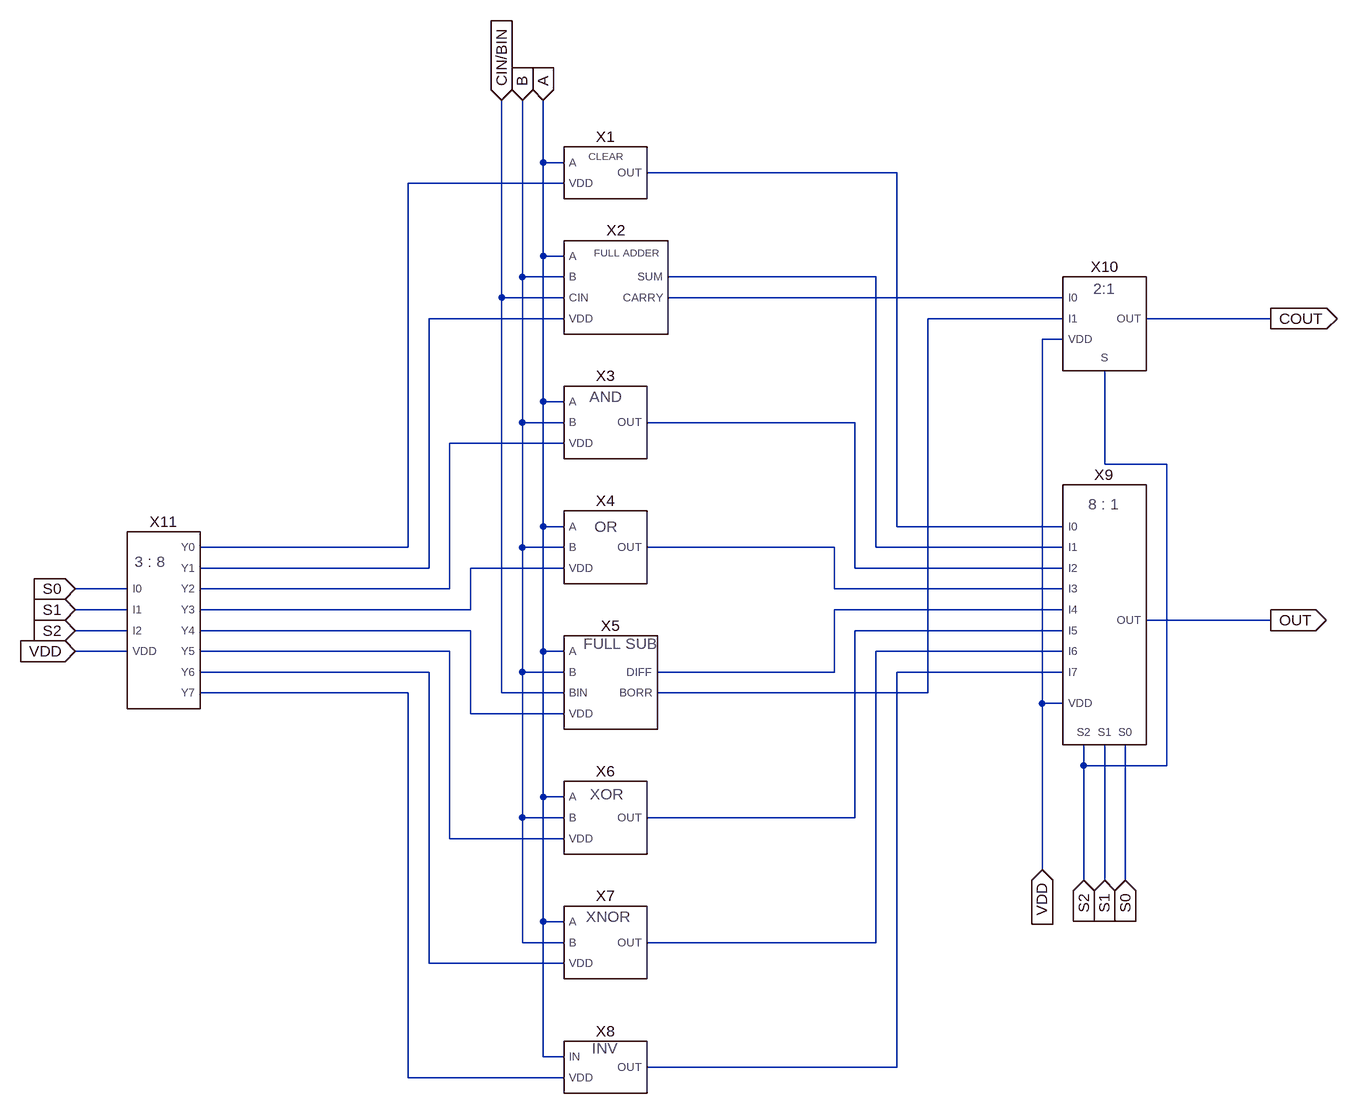
[diagram p0: schematic OneBitALU_CMOS.asc]
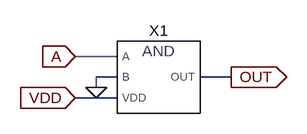
[diagram p1: sub-circuit clearcmos.asc]
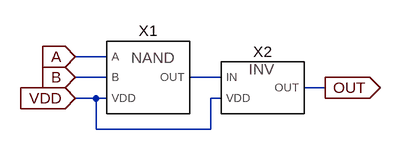
[diagram p2: sub-circuit andcmos.asc]
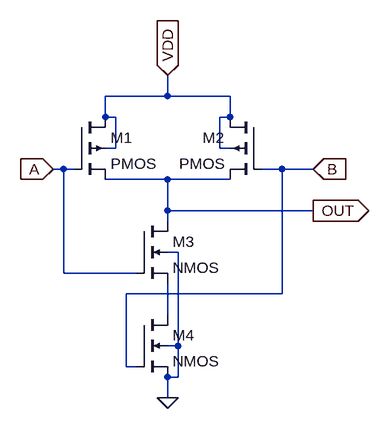
[diagram p3: sub-circuit nandcmos.asc]
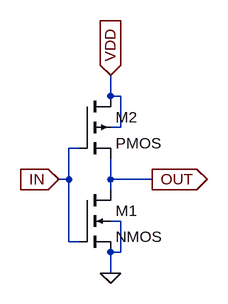
[diagram p4: sub-circuit invcmos.asc]
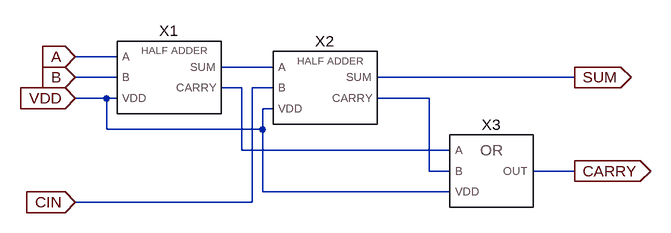
[diagram p5: sub-circuit fulladdercmos.asc]
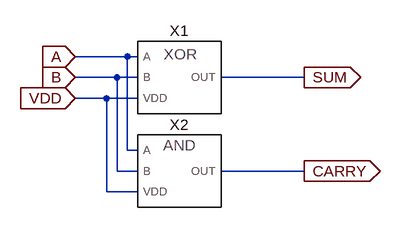
[diagram p6: sub-circuit halfaddercmos.asc]
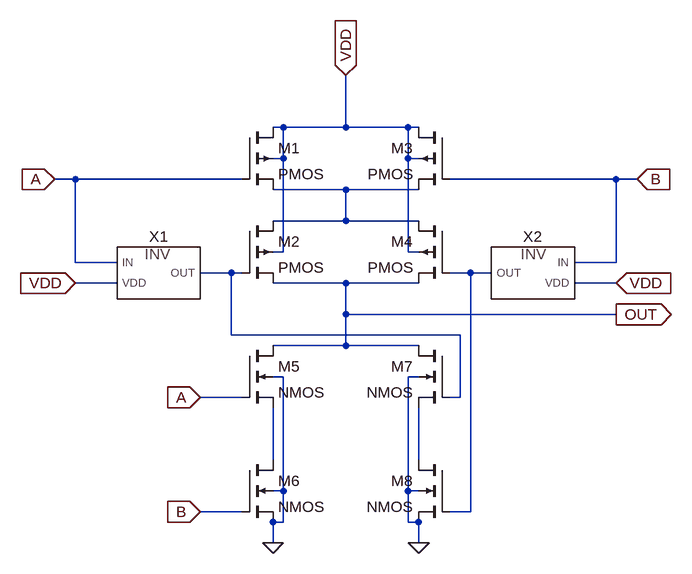
[diagram p7: sub-circuit xorcmos.asc]
OneBitALU_CMOS.asc, the LTspice schematic file:
Version 4
SHEET 1 1844 1388
WIRE 128 -48 128 -144
WIRE 160 -48 128 -48
WIRE 672 -32 288 -32
WIRE 160 -16 -80 -16
WIRE 128 96 128 -48
WIRE 160 96 128 96
WIRE 96 128 96 -144
WIRE 160 128 96 128
WIRE 640 128 320 128
WIRE 64 160 64 -144
WIRE 160 160 64 160
WIRE 928 160 320 160
WIRE 160 192 -48 192
WIRE 928 192 720 192
WIRE 1248 192 1056 192
WIRE 928 224 896 224
WIRE 128 320 128 96
WIRE 160 320 128 320
WIRE 96 352 96 128
WIRE 160 352 96 352
WIRE 608 352 288 352
WIRE 160 384 -16 384
WIRE 992 416 992 272
WIRE 1088 416 992 416
WIRE 128 512 128 320
WIRE 160 512 128 512
WIRE 672 512 672 -32
WIRE 928 512 672 512
WIRE -80 544 -80 -16
WIRE -80 544 -400 544
WIRE 96 544 96 352
WIRE 160 544 96 544
WIRE 576 544 288 544
WIRE 640 544 640 128
WIRE 928 544 640 544
WIRE -48 576 -48 192
WIRE -48 576 -400 576
WIRE 160 576 16 576
WIRE 608 576 608 352
WIRE 928 576 608 576
WIRE -512 608 -592 608
WIRE -16 608 -16 384
WIRE -16 608 -400 608
WIRE 576 608 576 544
WIRE 928 608 576 608
WIRE -512 640 -592 640
WIRE 16 640 16 576
WIRE 16 640 -400 640
WIRE 928 640 576 640
WIRE 1248 656 1056 656
WIRE -512 672 -592 672
WIRE 16 672 -400 672
WIRE 928 672 608 672
WIRE -512 704 -592 704
WIRE -16 704 -400 704
WIRE 128 704 128 512
WIRE 160 704 128 704
WIRE 928 704 640 704
WIRE -48 736 -400 736
WIRE 96 736 96 544
WIRE 160 736 96 736
WIRE 576 736 576 640
WIRE 576 736 304 736
WIRE 928 736 672 736
WIRE -80 768 -400 768
WIRE 64 768 64 160
WIRE 160 768 64 768
WIRE 720 768 720 192
WIRE 720 768 304 768
WIRE 896 784 896 224
WIRE 928 784 896 784
WIRE 16 800 16 672
WIRE 160 800 16 800
WIRE 960 880 960 848
WIRE 1088 880 1088 416
WIRE 1088 880 960 880
WIRE 128 928 128 704
WIRE 160 928 128 928
WIRE 96 960 96 736
WIRE 160 960 96 960
WIRE 608 960 608 672
WIRE 608 960 288 960
WIRE -16 992 -16 704
WIRE 160 992 -16 992
WIRE 896 1040 896 784
WIRE 960 1056 960 880
WIRE 992 1056 992 848
WIRE 1024 1056 1024 848
WIRE 128 1120 128 928
WIRE 160 1120 128 1120
WIRE 96 1152 96 960
WIRE 160 1152 96 1152
WIRE 640 1152 640 704
WIRE 640 1152 288 1152
WIRE -48 1184 -48 736
WIRE 160 1184 -48 1184
WIRE 128 1328 128 1120
WIRE 160 1328 128 1328
WIRE 672 1344 672 736
WIRE 672 1344 288 1344
WIRE -80 1360 -80 768
WIRE 160 1360 -80 1360
FLAG 896 1040 VDD
IOPIN 896 1040 In
FLAG 960 1056 S2
IOPIN 960 1056 In
FLAG 992 1056 S1
IOPIN 992 1056 In
FLAG 1024 1056 S0
IOPIN 1024 1056 In
FLAG 1248 192 COUT
IOPIN 1248 192 Out
FLAG 1248 656 OUT
IOPIN 1248 656 Out
FLAG -592 704 VDD
IOPIN -592 704 In
FLAG -592 672 S2
IOPIN -592 672 In
FLAG -592 640 S1
IOPIN -592 640 In
FLAG -592 608 S0
IOPIN -592 608 In
FLAG 128 -144 A
IOPIN 128 -144 In
FLAG 96 -144 B
IOPIN 96 -144 In
FLAG 64 -144 CIN/BIN
IOPIN 64 -144 In
SYMBOL ClearCMOS 224 -32 R0
SYMATTR InstName X1
SYMBOL FullAdderCMOS 240 144 R0
SYMATTR InstName X2
SYMBOL AndCMOS 224 352 R0
SYMATTR InstName X3
SYMBOL OrCMOS 224 544 R0
SYMATTR InstName X4
SYMBOL FullSubCMOS 224 752 R0
SYMATTR InstName X5
SYMBOL XorCMOS 224 960 R0
SYMATTR InstName X6
SYMBOL XnorCMOS 224 1152 R0
SYMATTR InstName X7
SYMBOL InvCMOS 224 1344 R0
SYMATTR InstName X8
SYMBOL Mux8to1CMOS 992 656 R0
SYMATTR InstName X9
SYMBOL Mux2to1CMOS 992 208 R0
SYMATTR InstName X10
SYMBOL Dec3to8CMOS -464 656 R0
SYMATTR InstName X11

clearcmos.asc, the sub-circuit schematic file:
Version 4
SHEET 1 880 680
WIRE 144 112 80 112
WIRE 144 144 112 144
WIRE 320 144 272 144
WIRE 112 160 112 144
WIRE 144 176 80 176
FLAG 80 176 VDD
IOPIN 80 176 In
FLAG 80 112 A
IOPIN 80 112 In
FLAG 112 160 0
FLAG 320 144 OUT
IOPIN 320 144 Out
SYMBOL AndCMOS 208 144 R0
SYMATTR InstName X1

andcmos.asc, the sub-circuit schematic file:
Version 4
SHEET 1 880 680
WIRE 112 112 64 112
WIRE 112 144 64 144
WIRE 288 144 240 144
WIRE 448 160 416 160
WIRE 96 176 64 176
WIRE 112 176 96 176
WIRE 288 176 272 176
WIRE 96 224 96 176
WIRE 272 224 272 176
WIRE 272 224 96 224
FLAG 64 112 A
IOPIN 64 112 In
FLAG 64 144 B
IOPIN 64 144 In
FLAG 64 176 VDD
IOPIN 64 176 In
FLAG 448 160 OUT
IOPIN 448 160 Out
SYMBOL NandCMOS 176 144 R0
SYMATTR InstName X1
SYMBOL InvCMOS 352 160 R0
SYMATTR InstName X2

nandcmos.asc, the sub-circuit schematic file:
Version 4
SHEET 1 880 680
WIRE -112 -160 -112 -192
WIRE -112 -160 -208 -160
WIRE -16 -160 -112 -160
WIRE -208 -128 -208 -160
WIRE -192 -128 -208 -128
WIRE -16 -128 -16 -160
WIRE -16 -128 -32 -128
WIRE -192 -80 -192 -128
WIRE -192 -80 -208 -80
WIRE -32 -80 -32 -128
WIRE -16 -80 -32 -80
WIRE -272 -48 -288 -48
WIRE -256 -48 -272 -48
WIRE 64 -48 32 -48
WIRE 112 -48 64 -48
WIRE -112 -32 -208 -32
WIRE -16 -32 -112 -32
WIRE -112 16 -112 -32
WIRE 112 16 -112 16
WIRE -112 32 -112 16
WIRE -96 80 -112 80
WIRE -272 112 -272 -48
WIRE -160 112 -272 112
WIRE 64 144 64 -48
WIRE 64 144 -176 144
WIRE -112 176 -112 128
WIRE -96 224 -96 80
WIRE -96 224 -112 224
WIRE -176 256 -176 144
WIRE -160 256 -176 256
WIRE -96 272 -96 224
WIRE -96 272 -112 272
WIRE -112 304 -112 272
FLAG -112 304 0
FLAG -112 -192 VDD
IOPIN -112 -192 In
FLAG -288 -48 A
IOPIN -288 -48 In
FLAG 112 -48 B
IOPIN 112 -48 In
FLAG 112 16 OUT
IOPIN 112 16 Out
SYMBOL pmos4 -256 -128 R0
SYMATTR InstName M1
SYMATTR Value2 l=65nm w=162.5nm
SYMBOL pmos4 32 -128 M0
SYMATTR InstName M2
SYMATTR Value2 l=65nm w=162.5nm
SYMBOL nmos4 -160 32 R0
SYMATTR InstName M3
SYMATTR Value2 l=65nm w=65nm
SYMBOL nmos4 -160 176 R0
SYMATTR InstName M4
SYMATTR Value2 l=65nm w=65nm

invcmos.asc, the sub-circuit schematic file:
Version 4
SHEET 1 880 680
WIRE 208 32 208 0
WIRE 224 32 208 32
WIRE 224 80 224 32
WIRE 224 80 208 80
WIRE 160 112 144 112
WIRE 144 160 144 112
WIRE 144 160 128 160
WIRE 208 160 208 128
WIRE 272 160 208 160
WIRE 208 176 208 160
WIRE 224 224 208 224
WIRE 144 256 144 160
WIRE 160 256 144 256
WIRE 224 272 224 224
WIRE 224 272 208 272
WIRE 208 304 208 272
FLAG 208 304 0
FLAG 208 0 VDD
IOPIN 208 0 In
FLAG 128 160 IN
IOPIN 128 160 In
FLAG 272 160 OUT
IOPIN 272 160 Out
SYMBOL nmos4 160 176 R0
SYMATTR InstName M1
SYMATTR Value2 l=65nm w=65nm
SYMBOL pmos4 160 32 R0
SYMATTR InstName M2
SYMATTR Value2 l=65nm w=162.5nm

fulladdercmos.asc, the sub-circuit schematic file:
Version 4
SHEET 1 892 680
WIRE 48 64 -16 64
WIRE 288 80 208 80
WIRE 48 96 -16 96
WIRE 752 96 448 96
WIRE 240 112 208 112
WIRE 288 112 256 112
WIRE 32 128 -16 128
WIRE 48 128 32 128
WIRE 528 128 448 128
WIRE 288 144 272 144
WIRE 32 176 32 128
WIRE 272 176 272 144
WIRE 272 176 32 176
WIRE 240 208 240 112
WIRE 560 208 240 208
WIRE 528 240 528 128
WIRE 560 240 528 240
WIRE 752 240 688 240
WIRE 272 272 272 176
WIRE 560 272 272 272
WIRE 256 288 256 112
WIRE 256 288 -16 288
FLAG -16 64 A
IOPIN -16 64 In
FLAG -16 96 B
IOPIN -16 96 In
FLAG -16 128 VDD
IOPIN -16 128 In
FLAG -16 288 CIN
IOPIN -16 288 In
FLAG 752 96 SUM
IOPIN 752 96 Out
FLAG 752 240 CARRY
IOPIN 752 240 Out
SYMBOL HalfAdderCMOS 128 96 R0
SYMATTR InstName X1
SYMBOL HalfAdderCMOS 368 112 R0
SYMATTR InstName X2
SYMBOL OrCMOS 624 240 R0
SYMATTR InstName X3

halfaddercmos.asc, the sub-circuit schematic file:
Version 4
SHEET 1 880 680
WIRE 144 64 64 64
WIRE 160 64 144 64
WIRE 128 96 64 96
WIRE 160 96 128 96
WIRE 416 96 288 96
WIRE 112 128 64 128
WIRE 160 128 112 128
WIRE 144 208 144 64
WIRE 160 208 144 208
WIRE 128 240 128 96
WIRE 160 240 128 240
WIRE 416 240 288 240
WIRE 112 272 112 128
WIRE 160 272 112 272
FLAG 64 64 A
IOPIN 64 64 In
FLAG 64 96 B
IOPIN 64 96 In
FLAG 64 128 VDD
IOPIN 64 128 In
FLAG 416 96 SUM
IOPIN 416 96 Out
FLAG 416 240 CARRY
IOPIN 416 240 Out
SYMBOL XorCMOS 224 96 R0
SYMATTR InstName X1
SYMBOL AndCMOS 224 240 R0
SYMATTR InstName X2

xorcmos.asc, the sub-circuit schematic file:
Version 4
SHEET 1 880 720
WIRE 160 32 144 32
WIRE 256 32 256 -48
WIRE 256 32 160 32
WIRE 352 32 256 32
WIRE 368 32 352 32
WIRE 160 80 160 32
WIRE 160 80 144 80
WIRE 352 80 352 32
WIRE 368 80 352 80
WIRE -160 112 -192 112
WIRE 96 112 -160 112
WIRE 672 112 416 112
WIRE 704 112 672 112
WIRE 256 128 144 128
WIRE 368 128 256 128
WIRE 256 176 256 128
WIRE 256 176 144 176
WIRE 368 176 256 176
WIRE 160 224 160 80
WIRE 160 224 144 224
WIRE 352 224 352 80
WIRE 368 224 352 224
WIRE -160 240 -160 112
WIRE -96 240 -160 240
WIRE 672 240 672 112
WIRE 672 240 608 240
WIRE 80 256 32 256
WIRE 96 256 80 256
WIRE 448 256 416 256
WIRE 480 256 448 256
WIRE -96 272 -160 272
WIRE 256 272 144 272
WIRE 368 272 256 272
WIRE 672 272 608 272
WIRE 256 320 256 272
WIRE 672 320 256 320
WIRE 80 352 80 256
WIRE 432 352 80 352
WIRE 256 368 256 320
WIRE 256 368 144 368
WIRE 368 368 256 368
WIRE 160 416 144 416
WIRE 368 416 352 416
WIRE 96 448 32 448
WIRE 432 448 432 352
WIRE 432 448 416 448
WIRE 144 544 144 464
WIRE 368 544 368 464
WIRE 160 592 160 416
WIRE 160 592 144 592
WIRE 352 592 352 416
WIRE 368 592 352 592
WIRE 96 624 32 624
WIRE 448 624 448 256
WIRE 448 624 416 624
WIRE 160 640 160 592
WIRE 160 640 144 640
WIRE 352 640 352 592
WIRE 368 640 352 640
WIRE 144 672 144 640
WIRE 368 672 368 640
FLAG 144 672 0
FLAG 368 672 0
FLAG -192 112 A
IOPIN -192 112 In
FLAG 704 112 B
IOPIN 704 112 In
FLAG 256 -48 VDD
IOPIN 256 -48 In
FLAG -160 272 VDD
IOPIN -160 272 In
FLAG 672 272 VDD
IOPIN 672 272 In
FLAG 32 448 A
IOPIN 32 448 In
FLAG 32 624 B
IOPIN 32 624 In
FLAG 672 320 OUT
IOPIN 672 320 Out
SYMBOL pmos4 96 32 R0
SYMATTR InstName M1
SYMATTR Value2 l=65nm w=162.5nm
SYMBOL pmos4 96 176 R0
SYMATTR InstName M2
SYMATTR Value2 l=65nm w=162.5nm
SYMBOL pmos4 416 32 M0
SYMATTR InstName M3
SYMATTR Value2 l=65nm w=162.5nm
SYMBOL pmos4 416 176 M0
SYMATTR InstName M4
SYMATTR Value2 l=65nm w=162.5nm
SYMBOL nmos4 96 368 R0
SYMATTR InstName M5
SYMATTR Value2 l=65nm w=65nm
SYMBOL nmos4 96 544 R0
SYMATTR InstName M6
SYMATTR Value2 l=65nm w=65nm
SYMBOL nmos4 416 368 M0
SYMATTR InstName M7
SYMATTR Value2 l=65nm w=65nm
SYMBOL nmos4 416 544 M0
SYMATTR InstName M8
SYMATTR Value2 l=65nm w=65nm
SYMBOL InvCMOS -32 256 R0
SYMATTR InstName X1
SYMBOL InvCMOS 544 256 M0
SYMATTR InstName X2

orcmos.asc, the sub-circuit schematic file:
Version 4
SHEET 1 880 680
WIRE 112 128 64 128
WIRE 112 160 64 160
WIRE 288 160 240 160
WIRE 448 176 416 176
WIRE 96 192 64 192
WIRE 112 192 96 192
WIRE 288 192 256 192
WIRE 96 240 96 192
WIRE 256 240 256 192
WIRE 256 240 96 240
FLAG 64 128 A
IOPIN 64 128 In
FLAG 64 160 B
IOPIN 64 160 In
FLAG 64 192 VDD
IOPIN 64 192 In
FLAG 448 176 OUT
IOPIN 448 176 Out
SYMBOL NorCMOS 176 160 R0
SYMATTR InstName X1
SYMBOL InvCMOS 352 176 R0
SYMATTR InstName X2

norcmos.asc, the sub-circuit schematic file:
Version 4
SHEET 1 880 680
WIRE 224 16 224 -16
WIRE 240 16 224 16
WIRE 240 64 240 16
WIRE 240 64 224 64
WIRE -96 96 -160 96
WIRE 176 96 -96 96
WIRE 224 160 224 112
WIRE 240 208 240 64
WIRE 240 208 224 208
WIRE 160 240 -160 240
WIRE 176 240 160 240
WIRE 224 304 224 256
WIRE 224 304 -16 304
WIRE 320 304 224 304
WIRE -16 336 -16 304
WIRE 224 336 224 304
WIRE 0 384 -16 384
WIRE 240 384 224 384
WIRE -96 416 -96 96
WIRE -64 416 -96 416
WIRE 160 416 160 240
WIRE 176 416 160 416
WIRE -16 464 -16 432
WIRE 0 464 0 384
WIRE 0 464 -16 464
WIRE 224 464 224 432
WIRE 224 464 0 464
WIRE 240 464 240 384
WIRE 240 464 224 464
WIRE 224 480 224 464
FLAG 224 480 0
FLAG 224 -16 VDD
IOPIN 224 -16 In
FLAG -160 96 A
IOPIN -160 96 In
FLAG -160 240 B
IOPIN -160 240 In
FLAG 320 304 OUT
IOPIN 320 304 Out
SYMBOL pmos4 176 16 R0
SYMATTR InstName M1
SYMATTR Value2 l=65nm w=162.5nm
SYMBOL pmos4 176 160 R0
SYMATTR InstName M2
SYMATTR Value2 l=65nm w=162.5nm
SYMBOL nmos4 -64 336 R0
SYMATTR InstName M3
SYMATTR Value2 l=65nm w=65nm
SYMBOL nmos4 176 336 R0
SYMATTR InstName M4
SYMATTR Value2 l=65nm w=65nm

fullsubcmos.asc, the sub-circuit schematic file:
Version 4
SHEET 1 1008 680
WIRE 112 112 16 112
WIRE 352 128 256 128
WIRE 112 144 16 144
WIRE 880 144 496 144
WIRE 304 160 256 160
WIRE 352 160 336 160
WIRE 96 176 16 176
WIRE 112 176 96 176
WIRE 576 176 496 176
WIRE 352 192 320 192
WIRE 96 224 96 176
WIRE 320 224 320 192
WIRE 320 224 96 224
WIRE 336 256 336 160
WIRE 336 256 16 256
WIRE 576 272 576 176
WIRE 608 272 576 272
WIRE 304 304 304 160
WIRE 608 304 304 304
WIRE 880 304 736 304
WIRE 320 336 320 224
WIRE 608 336 320 336
FLAG 16 112 A
IOPIN 16 112 In
FLAG 16 144 B
IOPIN 16 144 In
FLAG 16 176 VDD
IOPIN 16 176 In
FLAG 880 144 DIFF
IOPIN 880 144 Out
FLAG 880 304 BORR
IOPIN 880 304 Out
FLAG 16 256 BIN
IOPIN 16 256 In
SYMBOL HalfSubCMOS 176 144 R0
SYMATTR InstName X1
SYMBOL HalfSubCMOS 416 160 R0
SYMATTR InstName X2
SYMBOL OrCMOS 672 304 R0
SYMATTR InstName X3

halfsubcmos.asc, the sub-circuit schematic file:
Version 4
SHEET 1 880 680
WIRE 144 80 16 80
WIRE 160 80 144 80
WIRE 128 112 16 112
WIRE 160 112 128 112
WIRE 640 112 288 112
WIRE 112 144 16 144
WIRE 160 144 112 144
WIRE 144 224 144 80
WIRE 160 224 144 224
WIRE 352 240 288 240
WIRE 112 256 112 144
WIRE 160 256 112 256
WIRE 352 272 320 272
WIRE 640 272 480 272
WIRE 128 288 128 112
WIRE 320 288 320 272
WIRE 320 288 128 288
WIRE 112 304 112 256
WIRE 352 304 112 304
FLAG 16 80 A
IOPIN 16 80 In
FLAG 16 112 B
IOPIN 16 112 In
FLAG 16 144 VDD
IOPIN 16 144 In
FLAG 640 112 DIFF
IOPIN 640 112 Out
FLAG 640 272 BORR
IOPIN 640 272 Out
SYMBOL XorCMOS 224 112 R0
SYMATTR InstName X1
SYMBOL AndCMOS 416 272 R0
SYMATTR InstName X2
SYMBOL InvCMOS 224 240 R0
SYMATTR InstName X3

xnorcmos.asc, the sub-circuit schematic file:
Version 4
SHEET 1 880 756
WIRE 224 -16 224 -96
WIRE 224 -16 112 -16
WIRE 352 -16 224 -16
WIRE 112 16 112 -16
WIRE 128 16 112 16
WIRE 352 16 352 -16
WIRE 352 16 336 16
WIRE 128 64 128 16
WIRE 128 64 112 64
WIRE 336 64 336 16
WIRE 352 64 336 64
WIRE 720 80 608 80
WIRE 64 96 -80 96
WIRE 432 96 400 96
WIRE 480 96 432 96
WIRE 640 112 608 112
WIRE 704 112 640 112
WIRE 112 176 112 112
WIRE 352 176 352 112
WIRE 128 224 128 64
WIRE 128 224 112 224
WIRE 336 224 336 64
WIRE 352 224 336 224
WIRE 720 240 608 240
WIRE 64 256 -80 256
WIRE 464 256 400 256
WIRE 480 256 464 256
WIRE 224 272 112 272
WIRE 352 272 224 272
WIRE 640 272 640 112
WIRE 640 272 608 272
WIRE 224 336 224 272
WIRE 720 336 224 336
WIRE 224 368 224 336
WIRE 224 368 112 368
WIRE 352 368 224 368
WIRE 128 416 112 416
WIRE 352 416 336 416
WIRE 64 448 -80 448
WIRE 432 448 432 96
WIRE 432 448 400 448
WIRE 224 464 112 464
WIRE 352 464 224 464
WIRE 224 528 224 464
WIRE 224 528 112 528
WIRE 352 528 224 528
WIRE 128 576 128 416
WIRE 128 576 112 576
WIRE 336 576 336 416
WIRE 352 576 336 576
WIRE 64 608 16 608
WIRE 528 608 400 608
WIRE 128 624 128 576
WIRE 128 624 112 624
WIRE 224 624 128 624
WIRE 336 624 336 576
WIRE 336 624 224 624
WIRE 352 624 336 624
WIRE 224 672 224 624
WIRE 16 752 16 608
WIRE 464 752 464 256
WIRE 464 752 16 752
FLAG 224 672 0
FLAG 224 -96 VDD
IOPIN 224 -96 In
FLAG -80 96 A
IOPIN -80 96 In
FLAG -80 256 B
IOPIN -80 256 In
FLAG 720 80 A
IOPIN 720 80 In
FLAG 720 240 B
IOPIN 720 240 In
FLAG -80 448 A
IOPIN -80 448 In
FLAG 704 112 VDD
IOPIN 704 112 In
FLAG 528 608 B
IOPIN 528 608 In
FLAG 720 336 OUT
IOPIN 720 336 Out
SYMBOL pmos4 64 16 R0
SYMATTR InstName M1
SYMATTR Value2 l=65nm w=162.5nm
SYMBOL pmos4 400 16 M0
SYMATTR InstName M2
SYMATTR Value2 l=65nm w=162.5nm
SYMBOL pmos4 400 176 M0
SYMATTR InstName M3
SYMATTR Value2 l=65nm w=162.5nm
SYMBOL pmos4 64 176 R0
SYMATTR InstName M4
SYMATTR Value2 l=65nm w=162.5nm
SYMBOL nmos4 64 368 R0
SYMATTR InstName M5
SYMATTR Value2 l=65nm w=65nm
SYMBOL nmos4 64 528 R0
SYMATTR InstName M6
SYMATTR Value2 l=65nm w=65nm
SYMBOL nmos4 400 368 M0
SYMATTR InstName M7
SYMATTR Value2 l=65nm w=65nm
SYMBOL nmos4 400 528 M0
SYMATTR InstName M8
SYMATTR Value2 l=65nm w=65nm
SYMBOL InvCMOS 544 96 M0
SYMATTR InstName X1
SYMBOL InvCMOS 544 256 M0
SYMATTR InstName X2

mux8to1cmos.asc, the sub-circuit schematic file:
Version 4
SHEET 1 880 812
WIRE 176 48 128 48
WIRE 176 80 128 80
WIRE 176 112 128 112
WIRE 416 112 304 112
WIRE 176 144 128 144
WIRE -112 176 -192 176
WIRE 176 192 16 192
WIRE -112 208 -192 208
WIRE 416 272 416 112
WIRE 480 272 416 272
WIRE 480 304 416 304
WIRE 688 304 608 304
WIRE 224 320 224 240
WIRE 336 320 224 320
WIRE 272 336 272 240
WIRE 320 336 272 336
WIRE 480 336 448 336
WIRE 176 416 128 416
WIRE 176 448 128 448
WIRE 176 480 128 480
WIRE 416 480 416 304
WIRE 416 480 304 480
WIRE 176 512 128 512
WIRE 176 560 128 560
WIRE 272 624 272 608
WIRE 320 624 320 336
WIRE 320 624 272 624
WIRE 224 640 224 608
WIRE 336 640 336 320
WIRE 336 640 224 640
WIRE 224 704 224 640
WIRE 272 704 272 624
WIRE 448 704 448 336
WIRE 544 704 544 384
FLAG 448 704 VDD
IOPIN 448 704 In
FLAG 224 704 S1
IOPIN 224 704 In
FLAG 272 704 S0
IOPIN 272 704 In
FLAG 544 704 S2
IOPIN 544 704 In
FLAG 688 304 OUT
IOPIN 688 304 Out
FLAG 128 48 I0
IOPIN 128 48 In
FLAG 128 80 I1
IOPIN 128 80 In
FLAG 128 112 I2
IOPIN 128 112 In
FLAG 128 144 I3
IOPIN 128 144 In
FLAG 128 416 I4
IOPIN 128 416 In
FLAG 128 448 I5
IOPIN 128 448 In
FLAG 128 480 I6
IOPIN 128 480 In
FLAG 128 512 I7
IOPIN 128 512 In
FLAG -192 176 S2
IOPIN -192 176 In
FLAG -192 208 VDD
IOPIN -192 208 In
FLAG 128 560 S2
IOPIN 128 560 In
SYMBOL Mux4to1CMOS 240 128 R0
SYMATTR InstName X1
SYMBOL Mux4to1CMOS 240 496 R0
SYMATTR InstName X2
SYMBOL Mux2to1CMOS 544 320 R0
SYMATTR InstName X3
SYMBOL InvCMOS -48 192 R0
SYMATTR InstName X4

mux4to1cmos.asc, the sub-circuit schematic file:
Version 4
SHEET 1 880 680
WIRE 160 48 80 48
WIRE 160 80 80 80
WIRE 336 80 288 80
WIRE -112 96 -176 96
WIRE 160 112 16 112
WIRE -112 128 -176 128
WIRE 336 160 336 80
WIRE 368 160 336 160
WIRE 224 176 224 160
WIRE 304 176 224 176
WIRE 368 192 336 192
WIRE 560 192 496 192
WIRE 368 224 352 224
WIRE 160 240 80 240
WIRE 160 272 80 272
WIRE 336 272 336 192
WIRE 336 272 288 272
WIRE 160 304 80 304
WIRE 224 384 224 352
WIRE 304 384 304 176
WIRE 304 384 224 384
WIRE 224 416 224 384
WIRE 352 416 352 224
WIRE 432 416 432 272
FLAG 352 416 VDD
IOPIN 352 416 In
FLAG 80 48 I0
IOPIN 80 48 In
FLAG 80 80 I1
IOPIN 80 80 In
FLAG 80 240 I2
IOPIN 80 240 In
FLAG 80 272 I3
IOPIN 80 272 In
FLAG 560 192 OUT
IOPIN 560 192 Out
FLAG 224 416 S0
IOPIN 224 416 In
FLAG 432 416 S1
IOPIN 432 416 In
FLAG -176 96 S1
IOPIN -176 96 In
FLAG -176 128 VDD
IOPIN -176 128 In
FLAG 80 304 S1
IOPIN 80 304 In
SYMBOL Mux2to1CMOS 224 96 R0
SYMATTR InstName X1
SYMBOL Mux2to1CMOS 224 288 R0
SYMATTR InstName X2
SYMBOL Mux2to1CMOS 432 208 R0
SYMATTR InstName X3
SYMBOL InvCMOS -48 112 R0
SYMATTR InstName X4

mux2to1cmos.asc, the sub-circuit schematic file:
Version 4
SHEET 1 880 680
WIRE 176 -16 176 -32
WIRE 176 -16 128 -16
WIRE 208 -16 208 -96
WIRE 272 -16 208 -16
WIRE 176 16 176 -16
WIRE 208 16 208 -16
WIRE 192 256 192 144
WIRE 304 256 192 256
WIRE 304 288 48 288
WIRE 544 288 432 288
WIRE 128 320 128 -16
WIRE 304 320 128 320
WIRE 544 336 544 288
WIRE 576 336 544 336
WIRE 576 368 544 368
WIRE 768 368 704 368
WIRE 576 400 560 400
WIRE 272 432 272 -16
WIRE 304 432 272 432
WIRE 304 464 48 464
WIRE 544 464 544 368
WIRE 544 464 432 464
WIRE 128 496 128 320
WIRE 304 496 128 496
WIRE 560 496 560 400
FLAG 176 -32 VDD
IOPIN 176 -32 In
FLAG 208 -96 S
IOPIN 208 -96 In
FLAG 48 288 I0
IOPIN 48 288 In
FLAG 48 464 I1
IOPIN 48 464 In
FLAG 560 496 VDD
IOPIN 560 496 In
FLAG 768 368 OUT
IOPIN 768 368 Out
SYMBOL InvCMOS 192 80 R90
SYMATTR InstName X1
SYMBOL AndCMOS 368 288 R0
SYMATTR InstName X2
SYMBOL AndCMOS 368 464 R0
SYMATTR InstName X3
SYMBOL OrCMOS 640 368 R0
SYMATTR InstName X4

The netlist it stands for:
* OneBitALU_CMOS.asc
XX1 A N002 N001 clearcmos
XX2 A B CIN/BIN N005 N004 N003 fulladdercmos
XX3 A B N008 N007 andcmos
XX4 A B N010 N009 orcmos
XX5 A B CIN/BIN N012 N006 N011 fullsubcmos
XX6 A B N014 N013 xorcmos
XX7 A B N016 N015 xnorcmos
XX8 A N018 N017 invcmos
XX9 N001 N003 N007 N009 N011 N013 N015 N017 S0 S1 S2 VDD OUT mux8to1cmos
XX10 N004 N006 S2 VDD COUT mux2to1cmos
XX11 S0 S1 S2 VDD N002 N005 N008 N010 N012 N014 N016 N018 Dec3to8CMOS  ; pins I0 I1 I2 VDD Y0 Y1 Y2 Y3 Y4 Y5 Y6 Y7

* block symbol definitions
.subckt clearcmos A VDD OUT
XX1 A 0 VDD OUT andcmos
.ends clearcmos

.subckt andcmos A B VDD OUT
XX1 A B VDD N001 nandcmos
XX2 N001 VDD OUT invcmos
.ends andcmos

.subckt nandcmos A B VDD OUT
M1 VDD A OUT VDD PMOS l=65nm w=162.5nm
M2 VDD B OUT VDD PMOS l=65nm w=162.5nm
M3 OUT A N001 0 NMOS l=65nm w=65nm
M4 N001 B 0 0 NMOS l=65nm w=65nm
.ends nandcmos

.subckt invcmos IN VDD OUT
M1 OUT IN 0 0 NMOS l=65nm w=65nm
M2 VDD IN OUT VDD PMOS l=65nm w=162.5nm
.ends invcmos

.subckt fulladdercmos A B CIN VDD CARRY SUM
XX1 A B VDD N002 N001 halfaddercmos
XX2 N001 CIN VDD N003 SUM halfaddercmos
XX3 N002 N003 VDD CARRY orcmos
.ends fulladdercmos

.subckt halfaddercmos A B VDD CARRY SUM
XX1 A B VDD SUM xorcmos
XX2 A B VDD CARRY andcmos
.ends halfaddercmos

.subckt xorcmos A B VDD OUT
M1 VDD A N001 VDD PMOS l=65nm w=162.5nm
M2 N001 N002 OUT VDD PMOS l=65nm w=162.5nm
M3 VDD B N001 VDD PMOS l=65nm w=162.5nm
M4 N001 N003 OUT VDD PMOS l=65nm w=162.5nm
M5 OUT A N004 0 NMOS l=65nm w=65nm
M6 N004 B 0 0 NMOS l=65nm w=65nm
M7 OUT N002 N005 0 NMOS l=65nm w=65nm
M8 N005 N003 0 0 NMOS l=65nm w=65nm
XX1 A VDD N002 invcmos
XX2 B VDD N003 invcmos
.ends xorcmos

.subckt orcmos A B VDD OUT
XX1 A B VDD N001 norcmos
XX2 N001 VDD OUT invcmos
.ends orcmos

.subckt norcmos A B VDD OUT
M1 VDD A N001 VDD PMOS l=65nm w=162.5nm
M2 N001 B OUT VDD PMOS l=65nm w=162.5nm
M3 OUT A 0 0 NMOS l=65nm w=65nm
M4 OUT B 0 0 NMOS l=65nm w=65nm
.ends norcmos

.subckt fullsubcmos A B BIN VDD BORR DIFF
XX1 A B VDD N002 N001 halfsubcmos
XX2 N001 BIN VDD N003 DIFF halfsubcmos
XX3 N003 N002 VDD BORR orcmos
.ends fullsubcmos

.subckt halfsubcmos A B VDD BORR DIFF
XX1 A B VDD DIFF xorcmos
XX2 N001 B VDD BORR andcmos
XX3 A VDD N001 invcmos
.ends halfsubcmos

.subckt xnorcmos A B VDD OUT
M1 VDD A N002 VDD PMOS l=65nm w=162.5nm
M2 VDD N001 N003 VDD PMOS l=65nm w=162.5nm
M3 N003 N004 OUT VDD PMOS l=65nm w=162.5nm
M4 N002 B OUT VDD PMOS l=65nm w=162.5nm
M5 OUT A N005 0 NMOS l=65nm w=65nm
M6 N005 N004 0 0 NMOS l=65nm w=65nm
M7 OUT N001 N005 0 NMOS l=65nm w=65nm
M8 N005 B 0 0 NMOS l=65nm w=65nm
XX1 A VDD N001 invcmos
XX2 B VDD N004 invcmos
.ends xnorcmos

.subckt mux8to1cmos I0 I1 I2 I3 I4 I5 I6 I7 S0 S1 S2 VDD OUT
XX1 I0 I1 I2 I3 S0 S1 N002 N001 mux4to1cmos
XX2 I4 I5 I6 I7 S0 S1 S2 N003 mux4to1cmos
XX3 N001 N003 S2 VDD OUT mux2to1cmos
XX4 S2 VDD N002 invcmos
.ends mux8to1cmos

.subckt mux4to1cmos I0 I1 I2 I3 S0 S1 VDD OUT
XX1 I0 I1 S0 N002 N001 mux2to1cmos
XX2 I2 I3 S0 S1 N003 mux2to1cmos
XX3 N001 N003 S1 VDD OUT mux2to1cmos
XX4 S1 VDD N002 invcmos
.ends mux4to1cmos

.subckt mux2to1cmos I0 I1 S VDD OUT
XX1 S VDD N001 invcmos
XX2 N001 I0 VDD N002 andcmos
XX3 S I1 VDD N003 andcmos
XX4 N002 N003 VDD OUT orcmos
.ends mux2to1cmos

.model NMOS NMOS
.model PMOS PMOS
.lib standard.mos
.backanno
.end